# EAGLE design Dock P1RA (EAGLE 8.2.0)
AUTHOR: Simone Mora; CNAME: Tiles Dock; CREVISION: Rev A; DESIGNER: Simone Mora
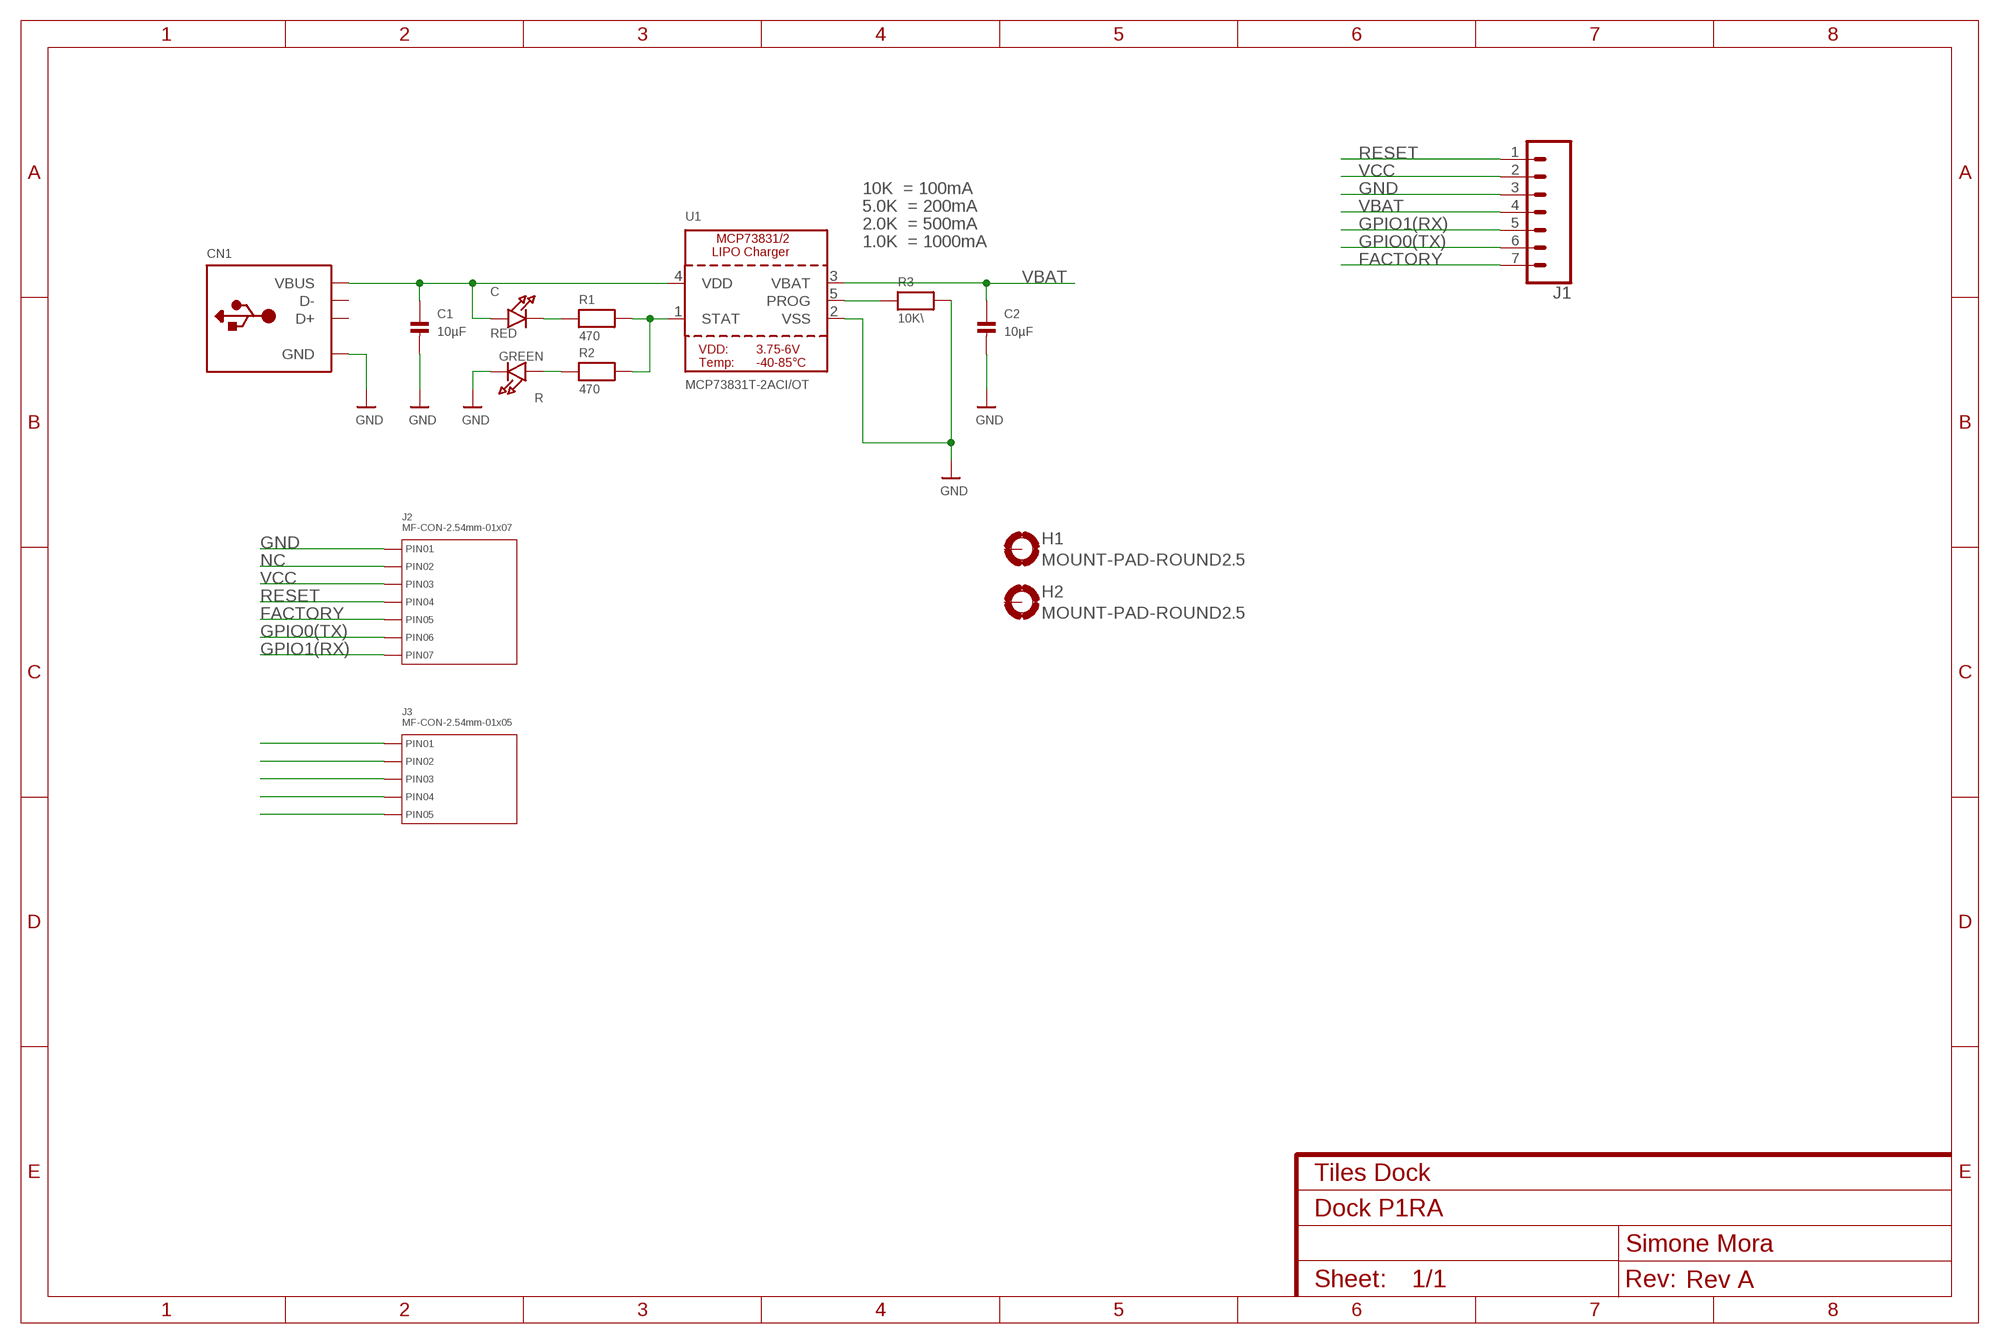
[diagram p0: schematic, sheet 1]

## Parts
C  RED  LED0805  [CHIPLED_0805]
C1  10µF  CAP_CERAMIC1206  [1206]
C2  10µF  CAP_CERAMIC1206  [1206]
CN1  USB_TYPEAPCB  [USBA_PCB]
H1  MOUNT-PAD-ROUND2.5  [2,5-PAD-SIM]
H2  MOUNT-PAD-ROUND2.5  [2,5-PAD-SIM]
J1  CONN_07_SIMSQPAD_TOP  [1X07_SQUAREPADS_TOP]
J2  MF-CON-2.54mm-01x07  CON_01X07_PTH_2.54MM  [PTH_2.54MM_01X07]
J3  MF-CON-2.54mm-01x05  CON_01X05_PTH_2.54MM  [PTH_2.54MM_01X05]
R  GREEN  LED0805  [CHIPLED_0805]
R1  470  RESISTOR0805  [0805]
R2  470  RESISTOR0805  [0805]
R3  10K\  RESISTOR0805  [0805]
U1  MCP73831T-2ACI/OT  MCP73831/2  [SOT23-5]

## Nets
FACTORY: J1.7 J2.P$5(PIN5)
GND: C1.2 C2.2 CN1.GND J1.3 J2.P$1(PIN1) R3.2 R.C U1.2(VSS)
GPIO0(TX): J1.6 J2.P$6(PIN6)
GPIO1(RX): J1.5 J2.P$7(PIN7)
N$1: C.C R1.1
N$2: R1.2 R2.2 U1.1(STAT)
N$5: R3.1 U1.5(PROG)
N$6: R2.1 R.A
N$13: J3.P$1(PIN1)
N$14: J3.P$2(PIN2)
N$15: J3.P$3(PIN3)
N$16: J3.P$4(PIN4)
N$17: J3.P$5(PIN5)
NC: J2.P$2(PIN2)
RESET: J1.1 J2.P$4(PIN4)
VBAT: C2.1 J1.4 U1.3(VBAT)
VCC: J1.2 J2.P$3(PIN3)
VDD: C1.1 C.A CN1.VCC(VBUS) U1.4(VDD)
Unconnected: CN1.USB_NEG(D-) CN1.USB_PLUS(D+) H1.B2,8(MOUNT) H2.B2,8(MOUNT)

## Notes on the sheet
- 10K  = 100mA
- 5.0K  = 200mA
- 2.0K  = 500mA
- 1.0K  = 1000mA

## Library data of the parts
C R = microbuilder:LED: LED 0603 - 0603 Surface Mount Package 2mA: Green LED - Low Power (3.9mcd, 2ma, 1.7Vf) - Digikey: 475-2709-2-ND Orange LED - Low Power (9.8mcd, 2ma, 1.8Vf) - Digikey: 475-1194-2-ND Red LED - Low Power (5mcd, 2ma, 1.8Vf) - Digikey: 475-1195-2-ND Yellow LED - Low Power (7mcd, 2ma, 1.8Vf) - Digikey: 475-1196-2-ND 5mA: Blue LED - Low Power (17mcd, 5ma, 2.9Vf) - Digikey: LNJ937W8CRACT-ND 0805 - 0805 Surface Mount Package 2mA: Red LED (8.8mcd, 2mA, 1.8Vf, Clear) - Low Power [Digikey: 475-2510-1-ND] Green LED (5mcd, 2mA, 1.8Vf, Clear) - Low Power [Digikey: 475-2730-1-ND] Yellow LED (11.3mcd, 2mA, 1.8Vf, Clear) - Low Power [Digikey: 475-2555-1-ND] 20mA: Red LED (104mcd, 20mA, Diffused) - LS R976 [Digikey: 475-1278-6-ND] Red LED (12mcd, 20mA, 2.0Vf, Clear) - APT2012EC [Digikey: 754-1128-1-ND] Green LED (15mcd, 20mA, 2.2Vf, Clear) - APT2012GC [Digikey: 754-1131-1-ND] Orange LED (160mcd, 20mA, 2.1Vf, Clear) - APT2012SECK [Digikey: 754-1130-1-ND] 1206 - 1206 Surface Mount Package Green LED (26mcd, 20mA, Diffused) - LG N971 [Digikey: 475-1407-6-ND] Red LED (15mcd, 20mA, Diffused) - LH N974 [Digikey: 475-1416-6-ND] Cree - Cree High-Power Surface Mount LEDs XPEBWT-L1-0000-00D50 - White 111lm 350mA 2.9Vf 6200K 110° XTEAWT-00-0000-00000LEE3 - White 114lm 350mA 2.85Vf 5000K 115°
C1 C2 = microbuilder:CAP_CERAMIC: Ceramic Capacitors 0402 - 0402 Surface Mount Capacitors 16pF 50V 5% [Digikey: 445-4899-2-ND] 18pF 50V 5% [Digikey: 490-1281-2-ND] 22pF 50V 5% [Digikey: 490-1283-2-ND] 68pF 50V 5% [Digikey: 490-1289-2-ND] 0.1uF 10V 10% [Digikey: 490-1318-2-ND] 1.0uF 6.3V 10% [Digikey: 490-1320-2-ND] 0603 - 0603 Surface Mount Capacitors 16 pF 50V 5% [Digikey: 445-5051-2-ND] 22 pF 50V [Digikey: PCC220ACVTR-ND] 33 pF 50V 5% [Digikey: 490-1415-1-ND] 56pF 50V 5% [Digikey: 490-1421-1-ND] 220pF 50V 5% [Digikey: 445-1285-1-ND] 680 pF 50V 2200 pF 50V 5% C0G [Digikey: 445-1297-1-ND] 5600 pF 100V 5% X7R [Digikey: 478-3711-1-ND] 0.1 µF 25V 10% [Digikey: PCC2277TR-ND] 0.22 µF 16V 10% X7R [Digikey: 445-1318-1-ND] 1.0 µF 25V 10% [Digikey: 445-5146-2-ND] 0603 - RF Specific 3pF 250V +/-0.1pF RF [Digikey: 712-1347-1-ND] 18 pF 250V 5% [Digikey: 478-3505-1-ND or 712-1322-1-ND] 56 pF 250V 5% C0G RF [Digikey: 490-4867-1-ND] 68 pF 250V RF [Digikey: 490-4868-1-ND] 0805 - 0805 Surface Mount Capacitors 220 pF 250V 2% RF Ceramic Capacitor [Digikey: 712-1398-1-ND] 1000 pF 50V 2% NP0 Ceramic Capacitor [Digikey: 478-3760-1-ND] 0.1 µF 25V 10% Ceramic Capacitor [Digikey: PCC1828TR-ND] 1.0 µF 16V 10% Ceramic Capacitor[Digikey: 490-1691-2-ND] 10.0 µF 10V 10% Ceramic Capacitor[Digikey: 709-1228-1-ND] 10.0 uF 16V 10% Ceramic Capacitor [Digikey: 478-5165-2-ND] 47 uF 6.3V 20% Ceramic Capacitor [Digikey: 587-1779-1-ND or 399-5506-1-ND] 1206 - 1206 Surface Mount Capacitors 47uF 10V 20% Ceramic Capacitor [Digikey: 490-5528-1-ND or 399-5508-1-ND or 445-6010-1-ND] 100uF 6.3V -20%, +80% Y5V Ceramic Capacitor (Digikey: 490-4512-1-ND, Mouser: 81-GRM31CF50J107ZE1L)
CN1 = microbuilder:USB_TYPEA: USB - Type A Connectors Male types stick out and are inserted into a PC or matching females parts (these are the connectors used on USB Memory Sticks, etc.). Female parts are generally used for USB Host and accept a male-type connector. SMT Male - 4UCON: 10017 PTH Female - Digikey: 609-1045-ND, 4UCon: 05241
H1 H2 = tiles:MOUNT-PAD-ROUND: MOUNTING PAD, round
J1 = tiles:CONN_07_SIM: Multi connection point. Often used as Generic Header-pin footprint for 0.1 inch spaced/style header connections On any of the 0.1 inch spaced packages, you can populate with these: Break Away Headers - Straight <https://www.sparkfun.com/products/116> (PRT-00116) Break Away Male Headers - Right Angle <https://www.sparkfun.com/products/553> (PRT-00553) Female Headers <https://www.sparkfun.com/products/115> (PRT-00115) Break Away Headers - Machine Pin <https://www.sparkfun.com/products/117> (PRT-00117) Break Away Female Headers - Swiss Machine Pin <https://www.sparkfun.com/products/743> (PRT-00743) For SCREWTERMINALS and SPRING TERMINALS visit here: Screw Terimnals on SparkFun.com <https://www.sparkfun.com/search/results?term=Screw+Terminals> (5mm/3.5mm/2.54mm spacing) This device is also useful as a general connection point to wire up your design to another part of your project. Our various solder wires solder well into these plated through hole pads. Hook-Up Wire - Assortment (Stranded, 22 AWG) <https://www.sparkfun.com/products/11375> (PRT-11375) Hook-Up Wire - Assortment (Solid Core, 22 AWG) <https://www.sparkfun.com/products/11367> (PRT-11367) View the entire wire category on our website here <https://www.sparkfun.com/categories/141> Special notes: Molex polarized connector foot print use with SKU : PRT-08231 with associated crimp pins and housings. 1MM SMD Version SKU: PRT-10208 NOTES ON THE VARIANTS LOCK and LOCK_LONGPADS... This footprint was designed to help hold the alignment of a through-hole component (i.e. 6-pin header) while soldering it into place. You may notice that each hole has been shifted either up or down by 0.005 of an inch from it's more standard position (which is a perfectly straight line). This slight alteration caused the pins (the squares in the middle) to touch the edges of the holes. Because they are alternating, it causes a "brace" to hold the component in place. 0.005 has proven to be the perfect amount of "off-center" position when using our standard breakaway headers. Although looks a little odd when you look at the bare footprint, once you have a header in there, the alteration is very hard to notice. Also,if you push a header all the way into place, it is covered up entirely on the bottom side.
J2 = MF_Connectors:CON_01X07: Library: MF_Connectors Description: Header Connector with 7 Positions and 01 Rows. Use the LABEL Attribute to label the pin on the schematic and PCB. You can remove the attributes on the PCB by using the SMASH function on the part and then deleting the text.; HOUSEPART: YES; MPN: MF-CON-2.54mm-01x07; POPULATE: 1; URL: https://factory.macrofab.com/part/MF-CON-2.54mm-01x07
J3 = MF_Connectors:CON_01X05: Library: MF_Connectors Description: Header Connector with 5 Positions and 01 Rows. Use the LABEL Attribute to label the pin on the schematic and PCB. You can remove the attributes on the PCB by using the SMASH function on the part and then deleting the text.; HOUSEPART: YES; MPN: MF-CON-2.54mm-01x05; POPULATE: 1; URL: https://factory.macrofab.com/part/MF-CON-2.54mm-01x05
R1-R3 = microbuilder:RESISTOR: Resistors 0402 - 0402 Surface Mount Package 22 Ohm 1% 1/16W [Digikey: 311-22.0LRTR-ND] 33 Ohm 5% 1/16W 1.0K 5% 1/16W 1.5K 5% 1/16W 2.0K 1% 1/16W 10.0K 1% 1/16W [Digikey: 311-10.0KLRTR-ND] 10.0K 5% 1/16W [Digikey: RMCF0402JT10K0TR-ND] 12.1K 1% 1/16W [Digikey: 311-22.0LRTR-ND] 100.0K 5% 1/16W 0603 - 0603 Surface Mount Package 0 Ohm 1/10 Watt 1% Resistor 15 Ohm 1/10 Watt 1% Resistor 33 Ohm 1/10 Watt 1% Resistor 49.9 Ohm 1/10 Watt 1% Resistor 100 Ohm 1/10 Watt 1% Resistor 150 Ohm 1/10 Watt 1% Resistor 240 Ohm 1/10 Watt 1% Resistor 390 Ohm 1/10 Watt 1% Resistor 560 Ohm 1/10 Watt 1% Resistor 680 Ohm 1/10 Watt 1% Resistor 750 Ohm 1/10 Watt 1% Resistor 1.0K Ohm 1/10 Watt 1% Resistor 1.5K Ohm 1/10 Watt 1% Resistor 2.0K Ohm 1/10 Watt 1% Resistor 2.2K Ohm 1/10 Watt 1% Resistor 3.3K Ohm 1/10 Watt 1% Resistor 4.7K Ohm 1/10 Watt 1% Resistor 10.0K Ohm 1/10 Watt 1% Resistor 12.0K Ohm 1/10 Watt 1% Resistor 12.1K Ohm 1/10 Watt 1% Resistor 20.0K Ohm 1/10 Watt 1% Resistor 33.0K Ohm 1/10 Watt 1% Resistor 100.0K Ohm 1/10 Watt 1% Resistor 0805 - 0805 Surface Mount Package 0 Ohm 1/8 Watt 1% Resistor 33 Ohm 1/8 Watt 1% Resistor 100 Ohm 1/8 Watt 1% Resistor 150 Ohm 1/8 Watt 1% Resistor 200 Ohm 1/8 Watt 1% Resistor 240 Ohm 1/8 Watt 1% Resistor 330 Ohm 1/8 Watt 1% Resistor 390 Ohm 1/8 Watt 1% Resistor 470 Ohm 1/8 Watt 1% Resistor 1.0K Ohm 1/8 Watt 1% Resistor 1.5K Ohm 1/8 Watt 1% Resistor 2.0K Ohm 1/8 Watt 1% Resistor 4.7K Ohm 1/8 Watt 1% Resistor 5.1K Ohm 1/8 Watt 1% Resistor 5.6K Ohm 1/8 Watt 1% Resistor 10.0K Ohm 1/8 Watt 1% Resistor 22.0K Ohm 1/8 Watt 1% Resistor 33.0K Ohm 1/8 Watt 1% Resistor 100K Ohm 1/8 Watt 1% Resistor 1206 - 1206 Surface Mount Package 2012 - 2010 Surface Mount Package 0.11 Ohm 1/2 Watt 1% Resistor - Digikey: RHM.11UCT-ND
U1 = microbuilder:MCP73831/2: MCP73831/2 LIPO Charger VDD: 3.75 - 6V Temp -40 - 85°C Programmable Charge Rate: 15-500mA NOTE: STAT is a tri-state logic output on the MCP73831 and an open-drain output on the MCP73832. SOT23-5 with 4.2V output and tri-state logic on STAT = MCP73831T-2ACI/OT

## Board
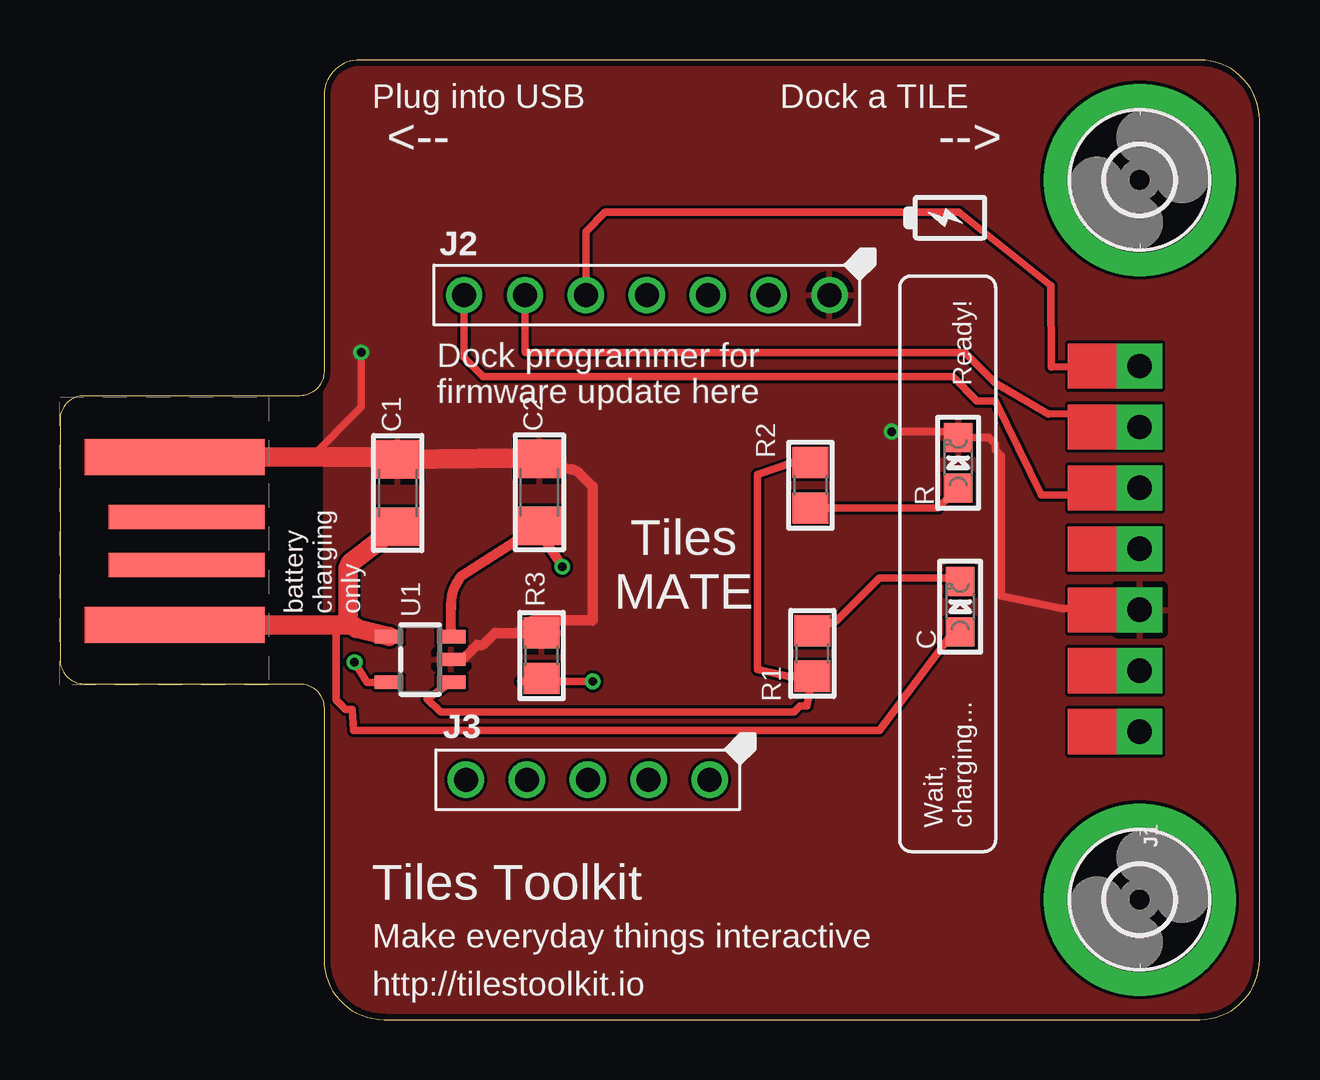
[diagram p1: board, top side]
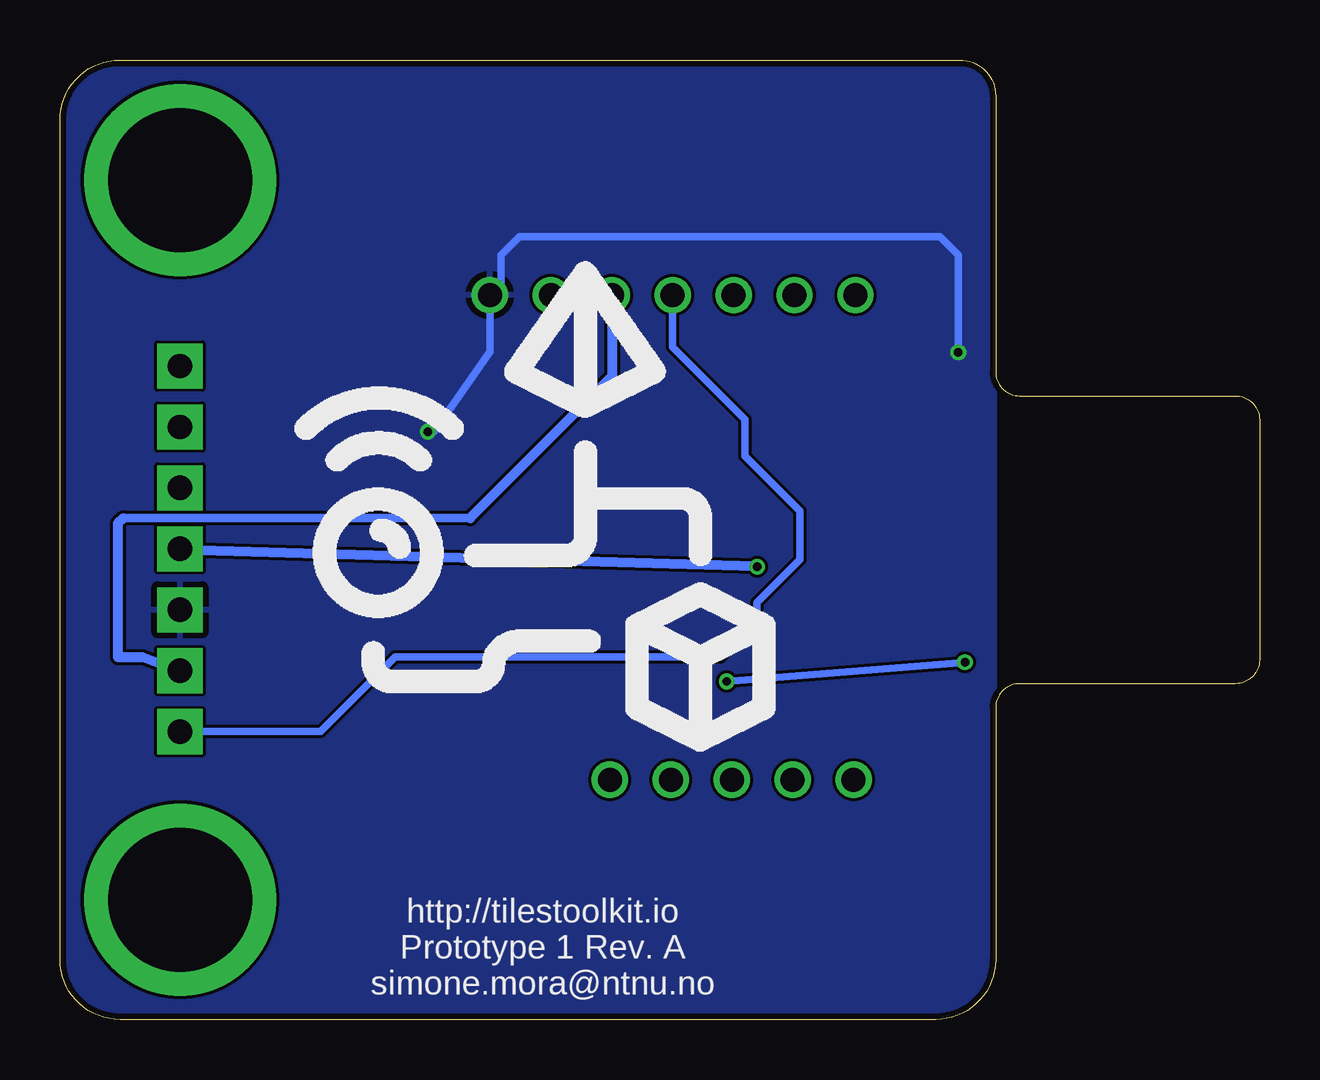
[diagram p2: board, bottom side, seen from below]

Size 50 x 40 mm. Coordinates in mm from the lower left corner, seen from the top.
Outline: 1,14 10,14 arc-90 11,13 11,2.5 arc90 13.5,0 47.5,0 arc90 50,2.5 50,37.5 arc90 47.5,40 12.5,40 arc90 11,38.5 11,27 arc-90 10,26 1,26 arc90 0,25 0,15 arc90 1,14
Copper layers (1*16): Top 0.035mm / dielectric 1.5mm / Bottom 0.035mm
Design rules "dirt_cheap_dirty_boards.v1": minimum track width 5mil, minimum drill 12mil, track to track 5mil, track to pad 5mil, pad to pad 5mil, via to via 5mil, smd to smd 0mil, copper to edge 10mil, drill to drill 10mil, minimum pad ring 10mil, minimum via ring 6mil, stop-mask expansion 2mil, vias tented up to drill 25mil, thermal gap 10mil

### Footprints (pad centres in the part's own frame; a part is rotated, then mirrored left to right if it is on the bottom)
CHIPLED_0805 = smd 1.2 x 1.2: A 0,-1.05; C 0,1.05
1206 = smd 1.6 x 1.8: 1 -1.4,0; 2 1.4,0
USBA_PCB = smd 7.5 x 1.5: GND -0.2,3.5; VCC -0.2,-3.5 | smd 6.5 x 1: USB_NEG 0.3,-1; USB_PLUS 0.3,1
2,5-PAD-SIM = drill 6 pad 8: B2,8 0,0
1X07_SQUAREPADS_TOP = drill 1.016 pad 1.88 square: 1 0,0; 2 2.54,0; 3 5.08,0; 4 7.62,0; 5 10.16,0; 6 12.7,0; 7 15.24,0
PTH_2.54MM_01X07 = drill 1: P$1 -7.62,0; P$2 -5.08,0; P$3 -2.54,0; P$4 0,0; P$5 2.54,0; P$6 5.08,0; P$7 7.62,0
PTH_2.54MM_01X05 = drill 1: P$1 -5.08,0; P$2 -2.54,0; P$3 0,0; P$4 2.54,0; P$5 5.08,0
0805 = smd 1.3 x 1.5: 1 -0.95,0; 2 0.95,0
SOT23-5 = smd 0.55 x 1.2: 1 -0.95,-1.3; 2 0,-1.3; 3 0.95,-1.3; 4 0.95,1.3; 5 -0.95,1.3

### Placement (x,y rotation side)
C  37.52,17.21 0 top
C1  14.08,21.95 90 top
C2  19.98,21.98 90 top
CN1  4.99,19.95 0 top
H1  45,35 0 top
H2  45,5 0 top
J1  45,12 90 top
J2  24.46,30.2 180 top
J3  22,10 180 top
R  37.44,23.21 0 top
R1  31.36,15.26 270 top
R2  31.28,22.27 90 top
R3  20.07,15.17 90 top
U1  15.01,15.01 90 top

### Tracks (layer width: path | path; a pad name or v marks a point on that pad's centre or on a via)
FACTORY
  Top 0.305: J2.P$5 21.92,32.85 22.72,33.65 37.46,33.65 41.31,30.6 41.33,27.2 J1.7
GND  (via drill 0.35)
  Top 0.305: 10.51,23.45 10.48,23.45 12.56,25.52 v12.56,27.81 | J1.3 44.93,17.14 41.75,17.14 39.24,17.65 39.24,23.49 38.99,23.74 38.99,24 38.73,24.26 R.C 37.19,24.51 v34.67,24.51
  Top 0.406: C2.2 21.29,22.93 arc-45 21.64,22.78 22.21,22.22 22.21,16.63 19.79,16.63 arc45 19.44,16.49 R3.2 19.07,16.12 18.14,16.12 17.64,15.62 17.38,15.62 16.92,15.16 arc-45 16.57,15.01 U1.2
  Top 0.813: CN1.GND 10.51,23.45 13.32,23.45 arc-45 13.68,23.3 C1.2 19.01,23.4 arc45 C2.2
  Bottom 0.305: v12.56,27.81 12.56,31.87 13.32,32.63 30.84,32.63 31.61,31.87 31.61,30.67 J2.P$1 32.08,27.84 34.42,24.51 v34.67,24.51
  pour Top: 11,40 50,40 50,0 13.5,0 arc-90 11,2.5
  pour Bottom: 11,40 50,40 50,0 13.5,0 arc-90 11,2.5
GPIO0(TX)
  Top 0.305: J2.P$6 19.38,27.84 19.41,27.81 37.72,27.81 38.99,26.54 41.2,25.24 42.77,25.27 42.77,24.99 43.05,24.71 44.98,24.71 J1.6
GPIO1(RX)
  Top 0.305: J2.P$7 16.84,27.59 17.64,26.79 37.21,26.79 38.23,25.78 38.99,25.78 40.9,21.86 42,21.86 42.72,22.14 43.97,22.14 J1.5
N$1
  Top 0.305: R1.1 32.36,16.62 34.15,18.41 37.37,18.41 C.C
N$2
  Top 0.305: U1.1 15.31,13.37 15.86,12.82 30.59,12.82 30.84,13.08 31.13,13.08 R1.2 30.37,14.31 29.08,14.6 29.08,22.73 30.59,23.24 31.26,23.24 R2.2
N$5  (via drill 0.35)
  Top 0.305: U1.5 12.81,14.06 v12.28,14.89 | v22.21,14.09 19.2,14.09 R3.1
  Bottom 0.305: v12.28,14.89 v22.21,14.09
N$6
  Top 0.305: R2.1 36.6,21.32 R.A
RESET
  Bottom 0.305: J2.P$4 24.46,28.03 21.45,25.01 21.45,23.49 19.16,21.2 19.16,19.17 20.94,17.39 20.94,16.63 22.46,15.11 36.04,15.11 39.14,12.01 44.98,12.01 J1.1
VBAT  (via drill 0.35)
  Top 0.406: U1.3 16.31,17.15 arc-45 16.76,18.51 C2.1 19.49,21.03 v20.94,18.88
  Bottom 0.406: v20.94,18.88 44.95,19.58 J1.4
VCC
  Bottom 0.356: 32.9,20.9 47.36,20.9
  Bottom 0.406: J2.P$3 27,26.83 32.9,20.9 | 47.36,20.9 47.59,20.7 47.59,15.11 46.56,15.11 J1.2
VDD
  Top 0.305: C.A 37.25,16.16 34.15,12.06 12.23,12.06 12.17,12.92 11.91,12.92 11.51,13.33 11.51,16.2 10.76,16.45
  Top 0.813: CN1.VCC 10.76,16.45 12.01,16.45 | 12.01,16.45 arc-45 12.37,16.3 U1.4 | 12.01,16.45 12.01,18.73 arc-45 12.16,19.08 C1.1

### Text on the board
tPlace: Plug into USB | Dock a TILE | <-- | --> | Ready! | Dock programmer for / firmware update here | Tiles / MATE | battery / charging / only | Wait, / charging... | Tiles Toolkit | Make everyday things interactive | http://tilestoolkit.io
bPlace: http://tilestoolkit.io / Prototype 1 Rev. A / simone.mora@ntnu.no